# Altium schematic sheet MB1428_Top.SchDoc: MB1428_Top
size A4; Date: Not used; ApprovedBy: Not used; CheckedBy: Not used; Author: Not used; CompanyName: STMicroelectronics; DrawnBy: Not used; Engineer: Not used; Organization: Not used; Address1: Not used; Address2: Not used; Address3: Not used; Address4: Not used; DocumentNumber: Not used; Revision: Not used; SheetNumber: 2; SheetTotal: 12; CurrentTime: Not used; CurrentDate: Not used; Time: Not used; DocumentFullPathAndName: Not used; DocumentName: Not used; ModifiedDate: Not used; ImagePath: Not used; ProjectName: Not used; Application_BuildNumber: Not used
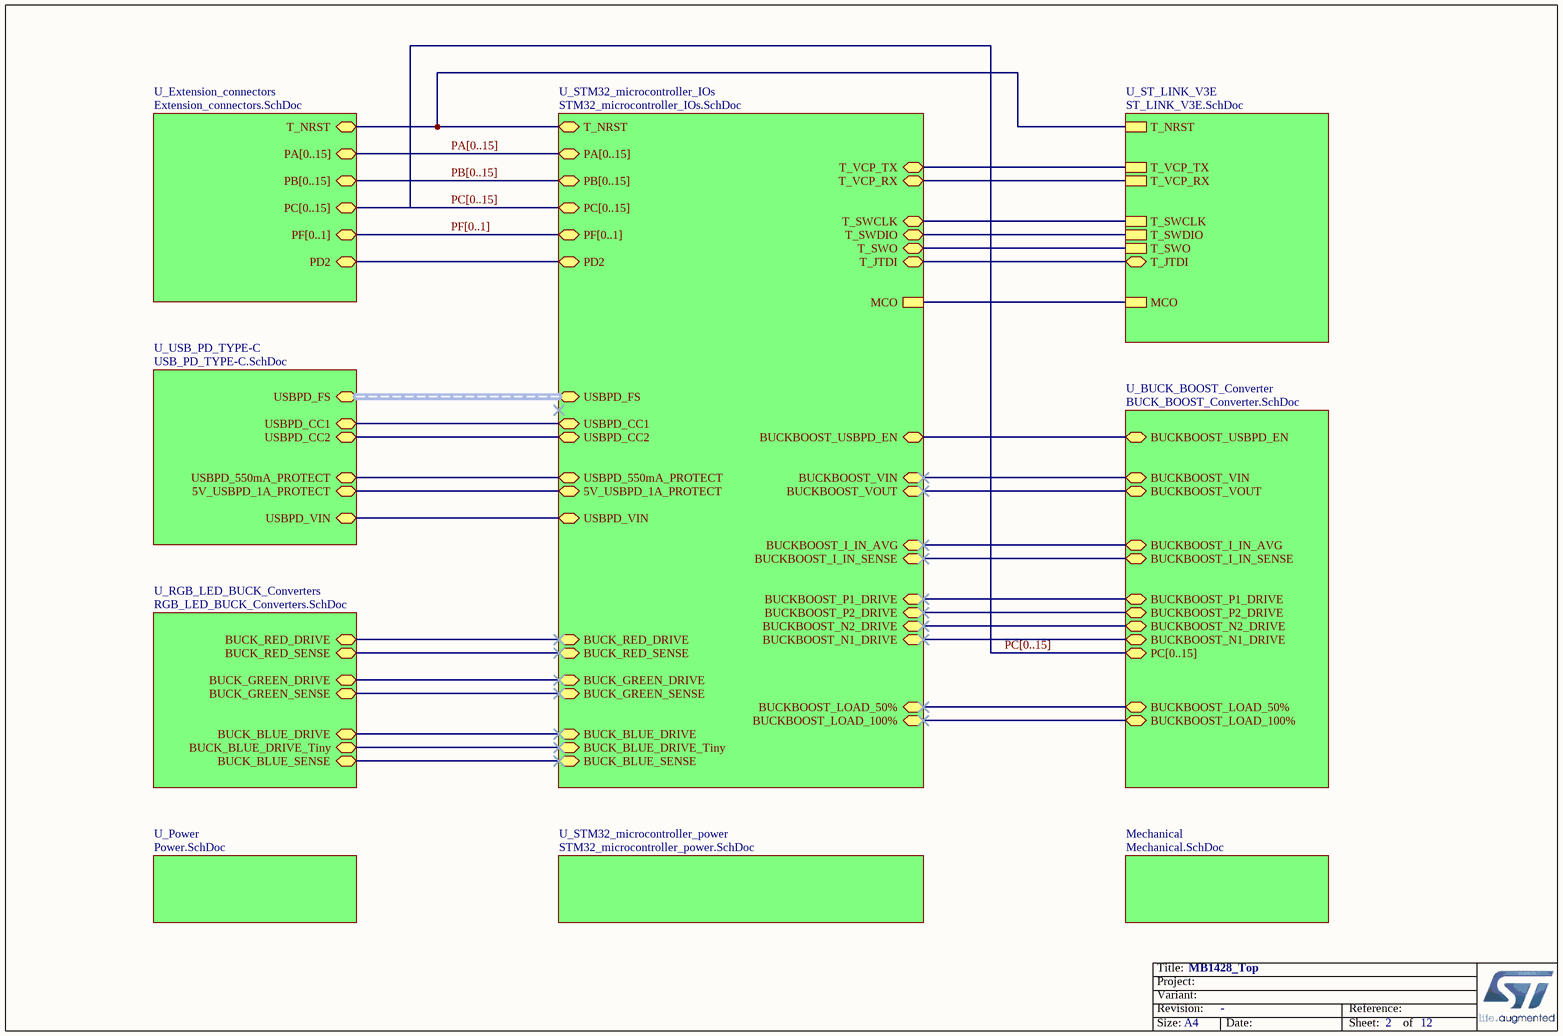
[diagram p0: MB1428_Top.SchDoc]

## Sub-sheets
Mechanical = Mechanical.SchDoc: no entries
U_BUCK_BOOST_Converter = BUCK_BOOST_Converter.SchDoc: PC[0..15] (bidir), BUCKBOOST_USBPD_EN, BUCKBOOST_VOUT, BUCKBOOST_VIN, BUCKBOOST_I_IN_SENSE, BUCKBOOST_I_IN_AVG, BUCKBOOST_P2_DRIVE, BUCKBOOST_P1_DRIVE, BUCKBOOST_N1_DRIVE, BUCKBOOST_N2_DRIVE, BUCKBOOST_LOAD_100%, BUCKBOOST_LOAD_50%
U_Extension_connectors = Extension_connectors.SchDoc: PA[0..15] (bidir), PB[0..15] (bidir), PC[0..15] (bidir), PF[0..1] (bidir), T_NRST, PD2
U_Power = Power.SchDoc: no entries
U_RGB_LED_BUCK_Converters = RGB_LED_BUCK_Converters.SchDoc: BUCK_GREEN_SENSE, BUCK_RED_DRIVE, BUCK_RED_SENSE, BUCK_GREEN_DRIVE, BUCK_BLUE_DRIVE, BUCK_BLUE_DRIVE_Tiny, BUCK_BLUE_SENSE
U_ST_LINK_V3E = ST_LINK_V3E.SchDoc: T_SWCLK, T_SWO, T_NRST, MCO, T_SWDIO, T_VCP_TX, T_VCP_RX, T_JTDI
U_STM32_microcontroller_IOs = STM32_microcontroller_IOs.SchDoc: PA[0..15] (bidir), PB[0..15] (bidir), PC[0..15] (bidir), PF[0..1] (bidir), MCO, PD2, T_NRST, T_VCP_TX, T_VCP_RX, T_SWCLK, T_SWO, T_SWDIO, T_JTDI, BUCKBOOST_USBPD_EN, BUCKBOOST_VIN, BUCKBOOST_VOUT, BUCKBOOST_I_IN_AVG, BUCKBOOST_I_IN_SENSE, BUCKBOOST_P2_DRIVE, BUCKBOOST_P1_DRIVE, BUCKBOOST_N1_DRIVE, BUCKBOOST_N2_DRIVE, BUCKBOOST_LOAD_100%, BUCKBOOST_LOAD_50%, USBPD_CC1, USBPD_CC2, 5V_USBPD_1A_PROTECT, USBPD_550mA_PROTECT, BUCK_GREEN_SENSE, BUCK_RED_DRIVE, BUCK_RED_SENSE, BUCK_GREEN_DRIVE, BUCK_BLUE_DRIVE, BUCK_BLUE_DRIVE_Tiny, BUCK_BLUE_SENSE, USBPD_FS (harness USBPDFS), USBPD_VIN
U_STM32_microcontroller_power = STM32_microcontroller_power.SchDoc: no entries
U_USB_PD_TYPE-C = USB_PD_TYPE-C.SchDoc: 5V_USBPD_1A_PROTECT, USBPD_CC1, USBPD_CC2, USBPD_550mA_PROTECT, USBPD_FS (harness USBPDFS), USBPD_VIN

## Nets
(unnamed): sheet U_Extension_connectors/T_NRST, sheet U_STM32_microcontroller_IOs/T_NRST, sheet U_ST_LINK_V3E/T_NRST
(unnamed): sheet U_Extension_connectors/PD2, sheet U_STM32_microcontroller_IOs/PD2
(unnamed): sheet U_STM32_microcontroller_IOs/MCO, sheet U_ST_LINK_V3E/MCO
(unnamed): sheet U_STM32_microcontroller_IOs/T_VCP_TX, sheet U_ST_LINK_V3E/T_VCP_TX
(unnamed): sheet U_STM32_microcontroller_IOs/T_VCP_RX, sheet U_ST_LINK_V3E/T_VCP_RX
(unnamed): sheet U_STM32_microcontroller_IOs/T_SWCLK, sheet U_ST_LINK_V3E/T_SWCLK
(unnamed): sheet U_STM32_microcontroller_IOs/T_SWO, sheet U_ST_LINK_V3E/T_SWO
(unnamed): sheet U_STM32_microcontroller_IOs/T_SWDIO, sheet U_ST_LINK_V3E/T_SWDIO
(unnamed): sheet U_STM32_microcontroller_IOs/T_JTDI, sheet U_ST_LINK_V3E/T_JTDI
(unnamed): sheet U_STM32_microcontroller_IOs/BUCKBOOST_USBPD_EN, sheet U_BUCK_BOOST_Converter/BUCKBOOST_USBPD_EN
(unnamed): sheet U_STM32_microcontroller_IOs/BUCKBOOST_VIN, sheet U_BUCK_BOOST_Converter/BUCKBOOST_VIN
(unnamed): sheet U_STM32_microcontroller_IOs/BUCKBOOST_VOUT, sheet U_BUCK_BOOST_Converter/BUCKBOOST_VOUT
(unnamed): sheet U_STM32_microcontroller_IOs/BUCKBOOST_I_IN_AVG, sheet U_BUCK_BOOST_Converter/BUCKBOOST_I_IN_AVG
(unnamed): sheet U_STM32_microcontroller_IOs/BUCKBOOST_I_IN_SENSE, sheet U_BUCK_BOOST_Converter/BUCKBOOST_I_IN_SENSE
(unnamed): sheet U_STM32_microcontroller_IOs/BUCKBOOST_P2_DRIVE, sheet U_BUCK_BOOST_Converter/BUCKBOOST_P2_DRIVE
(unnamed): sheet U_STM32_microcontroller_IOs/BUCKBOOST_P1_DRIVE, sheet U_BUCK_BOOST_Converter/BUCKBOOST_P1_DRIVE
(unnamed): sheet U_STM32_microcontroller_IOs/BUCKBOOST_N1_DRIVE, sheet U_BUCK_BOOST_Converter/BUCKBOOST_N1_DRIVE
(unnamed): sheet U_STM32_microcontroller_IOs/BUCKBOOST_N2_DRIVE, sheet U_BUCK_BOOST_Converter/BUCKBOOST_N2_DRIVE
(unnamed): sheet U_STM32_microcontroller_IOs/BUCKBOOST_LOAD_100%, sheet U_BUCK_BOOST_Converter/BUCKBOOST_LOAD_100%
(unnamed): sheet U_STM32_microcontroller_IOs/BUCKBOOST_LOAD_50%, sheet U_BUCK_BOOST_Converter/BUCKBOOST_LOAD_50%
(unnamed): sheet U_STM32_microcontroller_IOs/USBPD_CC1, sheet U_USB_PD_TYPE-C/USBPD_CC1
(unnamed): sheet U_STM32_microcontroller_IOs/USBPD_CC2, sheet U_USB_PD_TYPE-C/USBPD_CC2
(unnamed): sheet U_STM32_microcontroller_IOs/5V_USBPD_1A_PROTECT, sheet U_USB_PD_TYPE-C/5V_USBPD_1A_PROTECT
(unnamed): sheet U_STM32_microcontroller_IOs/USBPD_550mA_PROTECT, sheet U_USB_PD_TYPE-C/USBPD_550mA_PROTECT
(unnamed): sheet U_STM32_microcontroller_IOs/BUCK_GREEN_SENSE, sheet U_RGB_LED_BUCK_Converters/BUCK_GREEN_SENSE
(unnamed): sheet U_STM32_microcontroller_IOs/BUCK_RED_DRIVE, sheet U_RGB_LED_BUCK_Converters/BUCK_RED_DRIVE
(unnamed): sheet U_STM32_microcontroller_IOs/BUCK_RED_SENSE, sheet U_RGB_LED_BUCK_Converters/BUCK_RED_SENSE
(unnamed): sheet U_STM32_microcontroller_IOs/BUCK_GREEN_DRIVE, sheet U_RGB_LED_BUCK_Converters/BUCK_GREEN_DRIVE
(unnamed): sheet U_STM32_microcontroller_IOs/BUCK_BLUE_DRIVE, sheet U_RGB_LED_BUCK_Converters/BUCK_BLUE_DRIVE
(unnamed): sheet U_STM32_microcontroller_IOs/BUCK_BLUE_DRIVE_Tiny, sheet U_RGB_LED_BUCK_Converters/BUCK_BLUE_DRIVE_Tiny
(unnamed): sheet U_STM32_microcontroller_IOs/BUCK_BLUE_SENSE, sheet U_RGB_LED_BUCK_Converters/BUCK_BLUE_SENSE
(unnamed): sheet U_STM32_microcontroller_IOs/USBPD_VIN, sheet U_USB_PD_TYPE-C/USBPD_VIN

## Buses and harness runs
bus PA[0..15] = sheet U_Extension_connectors/PA[0..15] = sheet U_STM32_microcontroller_IOs/PA[0..15]
bus PB[0..15] = sheet U_Extension_connectors/PB[0..15] = sheet U_STM32_microcontroller_IOs/PB[0..15]
bus PC[0..15] = sheet U_BUCK_BOOST_Converter/PC[0..15] = sheet U_Extension_connectors/PC[0..15] = sheet U_STM32_microcontroller_IOs/PC[0..15]
bus PF[0..1] = sheet U_Extension_connectors/PF[0..1] = sheet U_STM32_microcontroller_IOs/PF[0..1]
harness sheet U_STM32_microcontroller_IOs/USBPD_FS = sheet U_USB_PD_TYPE-C/USBPD_FS

## Notes on the sheet
- Cuttable part on PCB
- Title:
- Project:
- Size:
- Revision:
- Variant:
- A4
- -
- Date:
- Reference:
- Sheet:
- of